# Altium schematic sheet ESP8266.SchDoc
size A4
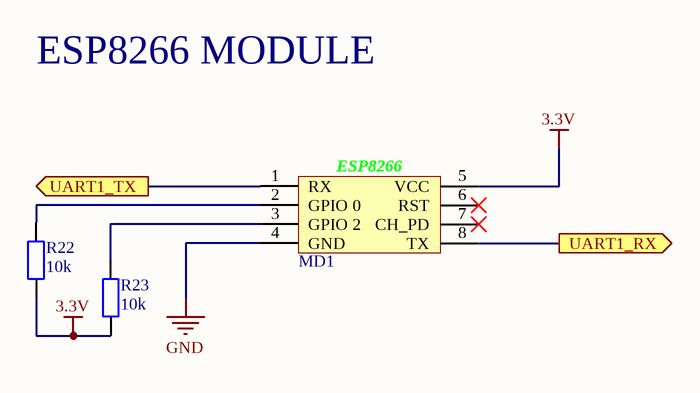
[diagram p0: ESP8266.SchDoc]

## Parts
MD1  ESP8266 Module  [ESP2866 Module]  (value not drawn)
R22  10k  [tro smd 0805]
R23  10k  [tro smd 0805]

## Ports
UART1_RX (out), UART1_TX (out)

## Nets
3.3V: MD1.5(VCC) R22.1 R23.1
GND: MD1.4(GND)
UART1_RX: MD1.8(TX) ; port UART1_RX
UART1_TX: MD1.1(RX) ; port UART1_TX
NetMD1_2: MD1.2(GPIO_0) R22.2
NetMD1_3: MD1.3(GPIO_2) R23.2

Not connected (* = marked no-connect by the designer): MD1 6(RST)* 7(CH_PD)*

## Notes on the sheet
- ESP8266 MODULE
- (in symbol ESP8266 Module) ESP8266

## Library data of the parts
R22 R23 = Tro 0805 5% 10k: Dán; Don_Vi: Con; So_Chan: 2; Ten_Linh_Kien: Trở 0805 5% 10k; Ma_Hang: MH005239; Chung_Loai: Dán; Kieu_Chan: *